# EAGLE design Mabee Soil Moisture Sensor  v1.0 (EAGLE 6.1)
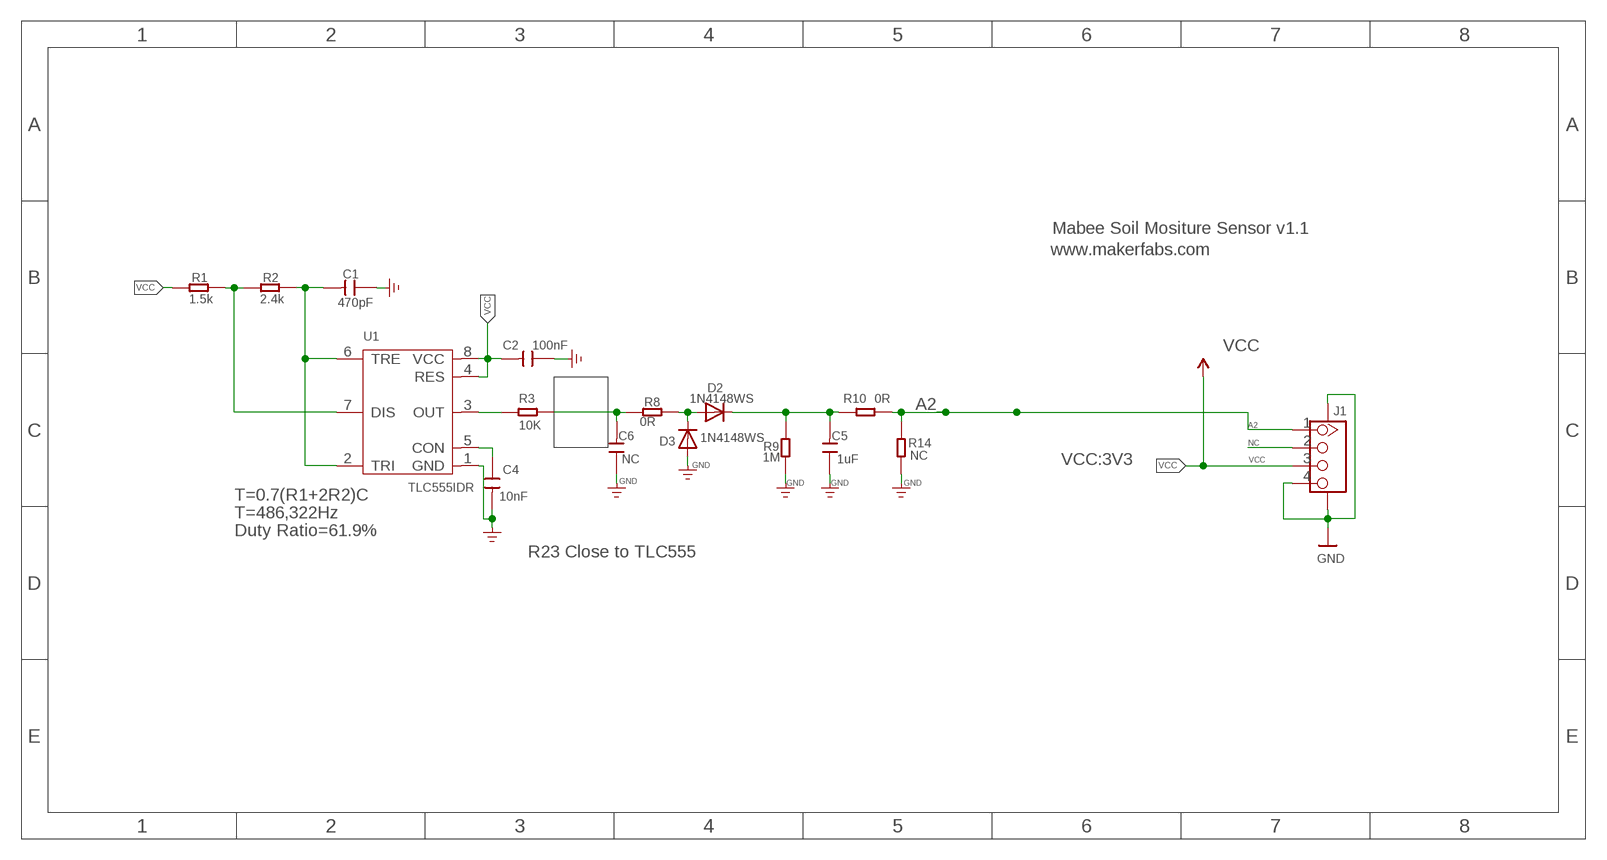
[diagram p0: schematic, sheet 1]

## Parts
C1  470pF  CAP-0603  [C0603]
C2  100nF  CAP-0603  [C0603]
C4  10nF  CAP-0603  [C0603]
C5  1uF  DISCRETE_C-0603  [DISCRETE_C0603]
C6  NC  DISCRETE_C-0603  [DISCRETE_C0603]
D2  1N4148WS  DIODESOD-323F  [SOD-323F]
D3  1N4148WS  DIODESOD-323F  [SOD-323F]
J1  J1  GROVE-CONNECTOR-SMD'90D'  [HW4-SMD-2.0-90D]
R1  1.5k  RES-0603  [R0603]
R2  2.4k  RES-0603  [R0603]
R3  10K  RES-0603  [R0603]
R8  0R  R-0603  [R0603]
R9  1M  R-0603  [R0603]
R10  0R  R-0603  [R0603]
R14  NC  R-0603  [R0603]
U1  TLC555IDR  CLOCK/TIMING-NE555'DR'  [SOIC8-1.27-5X4MM]

## Nets
A2: J1.1 R10.2 R14.1
GND: C1.1 C2.1 C4.2 C5.1 C6.1 D3.A J1.4 J1.SS1 J1.SS2 R9.1 R14.2 U1.1(GND)
N$1: R1.1 R2.2 U1.7(DIS)
N$2: C1.2 R2.1 U1.2(TRI) U1.6(TRE)
N$3: C4.1 U1.5(CON)
N$4: R3.1 U1.3(OUT)
N$5: C6.2 R3.2 R8.1
N$9: D2.A D3.C R8.2
N$11: C5.2 D2.C R9.2 R10.1
NC: J1.2
VCC: C2.2 J1.3 R1.2 U1.4(RES) U1.8(VCC)

## Notes on the sheet
- Mabee Soil Mositure Sensor v1.1
- www.makerfabs.com
- VCC:3V3
- T=0.7(R1+2R2)C
- T=486,322Hz
- Duty Ratio=61.9%
- R23 Close to TLC555

## Library data of the parts
C1 C2 C4 = Discrete-new:CAP: Ceramic Capacitors
C5 C6 = A9G:DISCRETE_C*: Ceramic Capacitors
D2 D3 = adafruit2:DIODE: Diode SMADIODE - SMA Surface Mount Package 20V 1A Schottky Diode Digikey: 641-1014-6-ND DO-1N4148 - Through Hole Small Current Diode SOD-123 20V 1 A (.5mV Vf) Schottky Diode - Digikey: MBRX120TPMSCT-ND SOD-323 10V 570mA (.38mV Vf, 3ns) Schottky Diode - Digikey: ZLLS410CT-ND SOD-523 30V 30mA Schottky Diode (RB751S-40TE61) - Digikey: RB751S-40TE61CT-ND SOT23-R/W - SOT23 Package (R = Solder Paste/Reflow Ovens, W = Hand-Soldering) BAT54Film 40V 300mA - Digikey: 497-7162-1-ND
J1 = Connector-new:GROVE-CONNECTOR-SMD: 4P-SMD-2.0:320110030;4P-SMD-2.0-90D:320110032
R1-R3 = Discrete-new:RES
R8-R10 R14 = Discrete:R*
U1 = IC-new:CLOCK/TIMING-NE555: DIP-8:310110001;SOIC-8:310110013;TSSOP-8:310110002

## Net classes
0 default: width 0.152 mm, drill 0.305 mm, clearance 0.152 mm

## Board
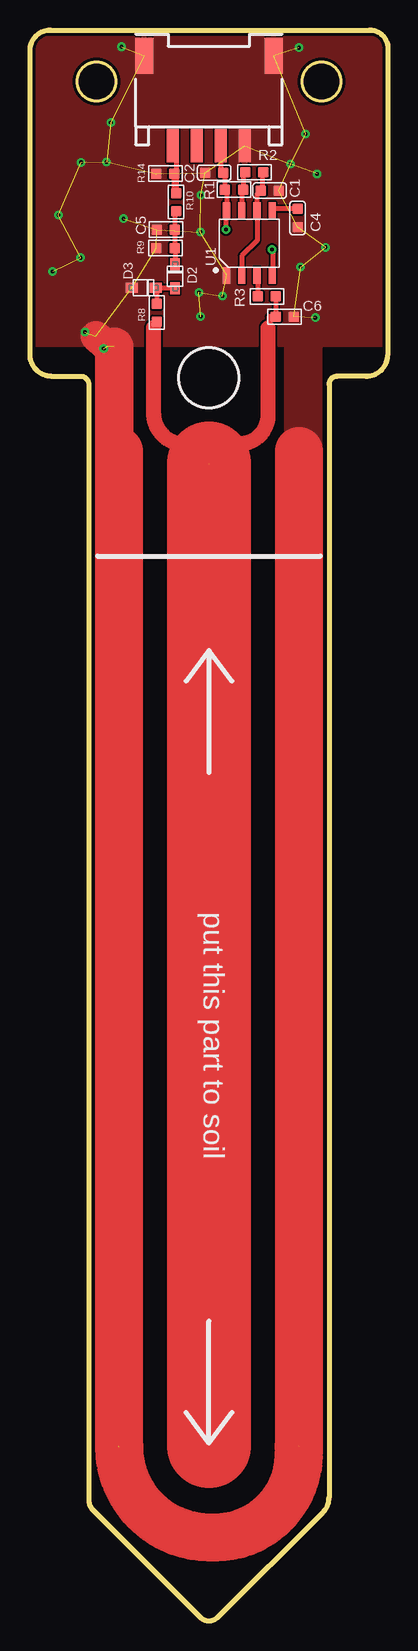
[diagram p1: board, top side]
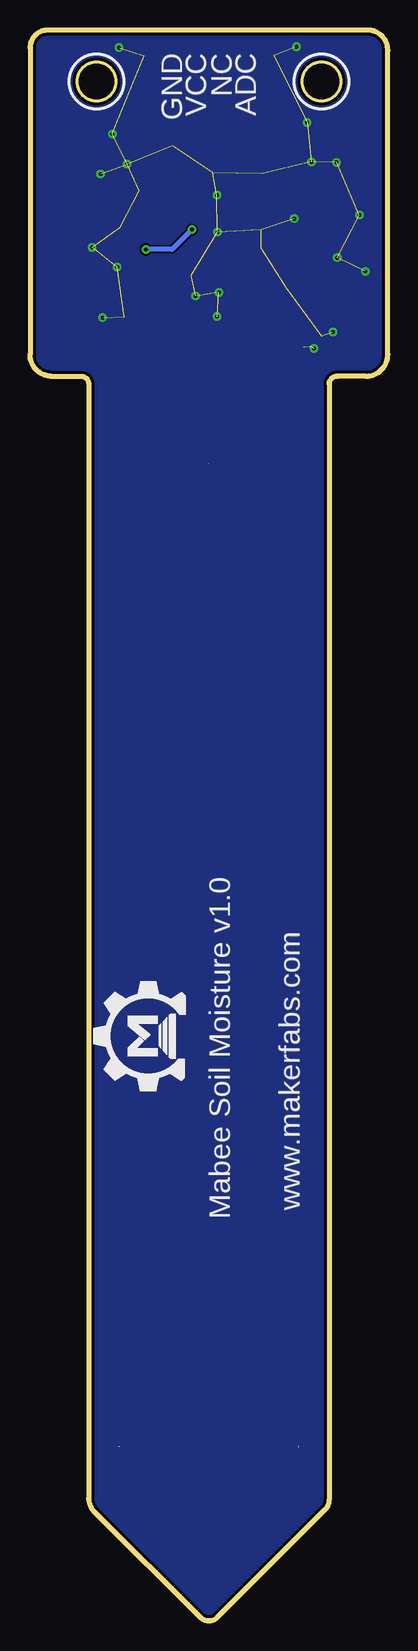
[diagram p2: board, bottom side, seen from below]

Size 29.82 x 132.58 mm. Coordinates in mm from the lower left corner, seen from the top.
Outline: 4.9,103.14 4.9,103.06
Outline: 4.9,103.06 4.9,10.07 arc45 5.24,9.25 14.2,0.3
Outline: 14.2,0.29 arc90 15.62,0.29
Outline: 28.07,103.72 25.59,103.72 arc90 24.92,103.05 24.92,10.28 arc-45 24.39,9.02 15.6,0.27
Outline: 27.99,103.72 arc90 29.82,105.53 29.82,131.06 arc90 28.3,132.58 1.69,132.58 arc90 0,130.89 0,105.53 arc89 1.8,103.72
Outline: 1.83,103.72 arc-1 1.8,103.72
Outline: 1.8,103.72 4.19,103.72 arc-90 4.9,103.06
Outline: circle at 5.54,128.29 radius 1.6
Outline: circle at 24.28,128.29 radius 1.6
Copper layers (1*16): Top 0.035mm / dielectric 1.5mm / Bottom 0.035mm
Design rules: minimum track width 10mil, minimum drill 12mil, track to track 6mil, track to pad 6mil, pad to pad 6mil, via to via 6mil, smd to smd 0mil, copper to edge 10mil, drill to drill 10mil, minimum pad ring 10mil, minimum via ring 8mil, stop-mask expansion 4mil, vias tented up to drill 100mil, thermal gap 0mil

### Footprints (pad centres in the part's own frame; a part is rotated, then mirrored left to right if it is on the bottom)
C0603 = smd 0.889 x 0.889: 1 0,0.762; 2 0,-0.762
DISCRETE_C0603 = smd 0.889 x 0.889: 1 -0.762,0; 2 0.762,0
SOD-323F = smd 1 x 0.8: A -1,0; C 1,0
HW4-SMD-2.0-90D = smd 1.01 x 2.74: 1 -3,-0.1; 2 -1,-0.1; 3 1,-0.1; 4 3,-0.1 | smd 1.5 x 3: SS1 -5.4,7.4; SS2 5.4,7.4
R0603 = smd 0.889 x 0.889: 1 0,0.762; 2 0,-0.762
R0603' = smd 0.889 x 0.889: 1 -0.762,0; 2 0.762,0
SOIC8-1.27-5X4MM = smd 0.6 x 1.4: 1 -1.905,-2.7; 2 -0.635,-2.7; 3 0.635,-2.7; 4 1.905,-2.7; 5 1.905,2.7; 6 0.635,2.7; 7 -0.635,2.7; 8 -1.905,2.7

### Placement (x,y rotation side)
C1  19.97,119.2 270 top
C2  15.35,120.69 90 top
C4  22.29,116.91 0 top
C5  11.32,115.95 0 top
C6  21.22,108.68 180 top
D2  12.1,112.06 90 top
D3  9.47,111.1 0 top
J1  14.91,123.03 0 top
R1  17,119.29 270 top
R2  18.69,120.72 270 top
R3  19.73,110.38 90 top
R8  0R  [R0603']  10.57,109.02 90 top
R9  1M  [R0603']  11.3,114.41 0 top
R10  0R  [R0603']  12.17,118.23 90 top
R14  NC  [R0603']  11.28,120.61 180 top
U1  18.28,114.83 0 top
U$7  [MAKERFABS_0.3]  16.91,44.62 90 bottom

### Tracks (layer width: path | path; a pad name or v marks a point on that pad's centre or on a via)
A2
  Top 0.406: J1.1 12.17,122.93 R10.2 12.17,118.79 12.04,118.79 R14.1
GND  (via drill 0.3)  (37 unrouted)
  Top 0.254: 6.78,97.4 6.67,97.4 arc-45 7.01,97.43
  Top 0.406: 7.04,97.51 7.01,97.51 7.01,97.65
  Top 2.54: 6.43,106.24 5.49,107.05 | 7.41,97.51 7.04,97.51
  Top 3.2: 7.01,97.43 7.01,97.65 7.01,106.16
  Top 4: 7.41,97.51 7.41,14.54 | 22.41,97.51 22.41,14.54 | 22.38,14.55 22.38,13.88 arc-90 15.44,6.95 14.99,6.95 arc-90 7.44,14.49
  other vias: 4.27,121.56 6.15,106.04 4.57,107.41 6.38,121.58 6.73,124.88 22.96,123.92 1.88,112.46 2.36,117.16 7.62,131.18 22.4,131.11 4.22,113.61 22.56,112.82 16.03,110.4 14.2,115.74 23.93,120.59 24.64,114.47 23.77,108.6 14.25,118.81 21.72,121.4 7.8,116.86 14.22,108.7 14.07,110.71
  pour Top: 21.49,107.38 24.13,107.38 arc90 24.16,107.41 24.16,97.43 22.05,97.43 arc-90 21.41,98.06 21.41,107.41
  pour Bottom: 0.46,132.15 29.54,132.15 arc-90 29.62,132.07 arc90 29.49,131.94 29.49,-0.31 1.12,-0.31 arc-90 0.48,0.32 0.48,132.12
  pour Top: 0.46,132.15 29.46,132.15 29.46,106.34 0.51,106.34 0.51,132.1
N$1
  Top 0.406: R2.2 17.76,120.72 R1.1 17.65,119.29 U1.7
N$2
  Top 0.406: R2.1 19.44,120.72 19.35,120.72 19.35,119.19 19.22,119.19 C1.2 18.92,118.91 U1.6 18.92,115.02 17.65,113.76 U1.2
N$3
  Top 0.406: C4.1 20.19,117.68 U1.5
N$4
  Top 0.406: U1.3 18.97,112.13 R3.1
N$5  (1 unrouted)
  Top 0.406: 12.9,98.06 14.93,96.43 | R3.2 20.46,110.38 C6.2 19.91,108.68 19.91,107.69 19.84,107.69 19.84,107.66 | 19.82,100.46 19.84,100.46 | R8.1 10.29,107.79
  Top 1.27: 19.82,100.46 arc-90 17.45,98.09 arc-90 17.42,98.06 12.9,98.06 arc-90 10.29,100.68 10.29,101.39 10.29,102.45 10.29,107.79 | 19.84,100.46 19.84,107.66 19.84,107.76
  Top 7: 14.91,96.43 14.91,14.58
N$9
  Top 0.406: D2.A 12.1,111.1 D3.C 10.56,111.1 R8.2
N$11
  Top 0.406: C5.2 12.08,117.46 R10.1 12.06,117.46 R9.2 12.1,114.41 D2.C
VCC  (via drill 0.3)
  Top 0.406: v16.33,115.94 16.33,117.53 U1.8 16.38,119.29 R1.2 16.23,120.69 C2.2 16,120.69 16,120.74 15.91,120.83 J1.3 | v20.17,114.29 20.24,114.21 20.24,112.16 20.22,112.16 U1.4
  Bottom 0.406: v16.33,115.94 17.98,114.29 v20.17,114.29

### Text on the board
tPlace: put this part to soil
bPlace: ADC | NC | VCC | GND | Mabee Soil Moisture v1.0 | www.makerfabs.com